# EAGLE design imu (EAGLE 5.12)
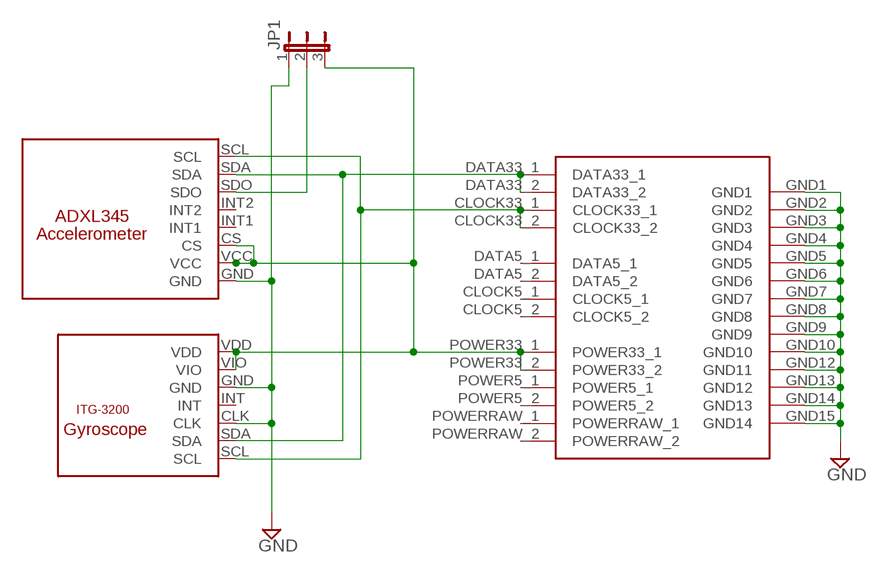
[diagram p0: schematic, sheet 1]

## Parts
JP1  JP2E  [JP2]
U$1  ADXL345_BREAKOUT  [ADXL345_BREAKOUT]
U$2  ITG3200_BREAKOUT  [ITG3200_BREAKOUT]
U$3  OPENSONDE_BUS  [OPENSONDE_BUS]

## Nets
GND: JP1.1 U$1.GND U$2.CLK U$2.GND U$3.GND1 U$3.GND2 U$3.GND3 U$3.GND4 U$3.GND5 U$3.GND6 U$3.GND7 U$3.GND8 U$3.GND9 U$3.GND10 U$3.GND12(GND11) U$3.GND13(GND12) U$3.GND14(GND13) U$3.GND15(GND14)
N$1: U$1.SDA U$2.SDA U$3.DATA33_1 U$3.DATA33_2
N$2: U$1.SCL U$2.SCL U$3.CLOCK33_1 U$3.CLOCK33_2
N$4: JP1.2 U$1.SDO
N$5: JP1.3 U$1.CS U$1.VCC U$2.VDD U$2.VIO U$3.POWER33_1 U$3.POWER33_2
Unconnected: U$1.INT1 U$1.INT2 U$2.INT U$3.CLOCK5_1 U$3.CLOCK5_2 U$3.DATA5_1 U$3.DATA5_2 U$3.POWER5_1 U$3.POWER5_2 U$3.POWERRAW_1 U$3.POWERRAW_2

## Library data of the parts
JP1 = jumper:JP2E: JUMPER
U$1 = Breakouts:ADXL345_BREAKOUT
U$2 = Breakouts:ITG3200_BREAKOUT
U$3 = OpenSondeBus:OPENSONDE_BUS

## Board
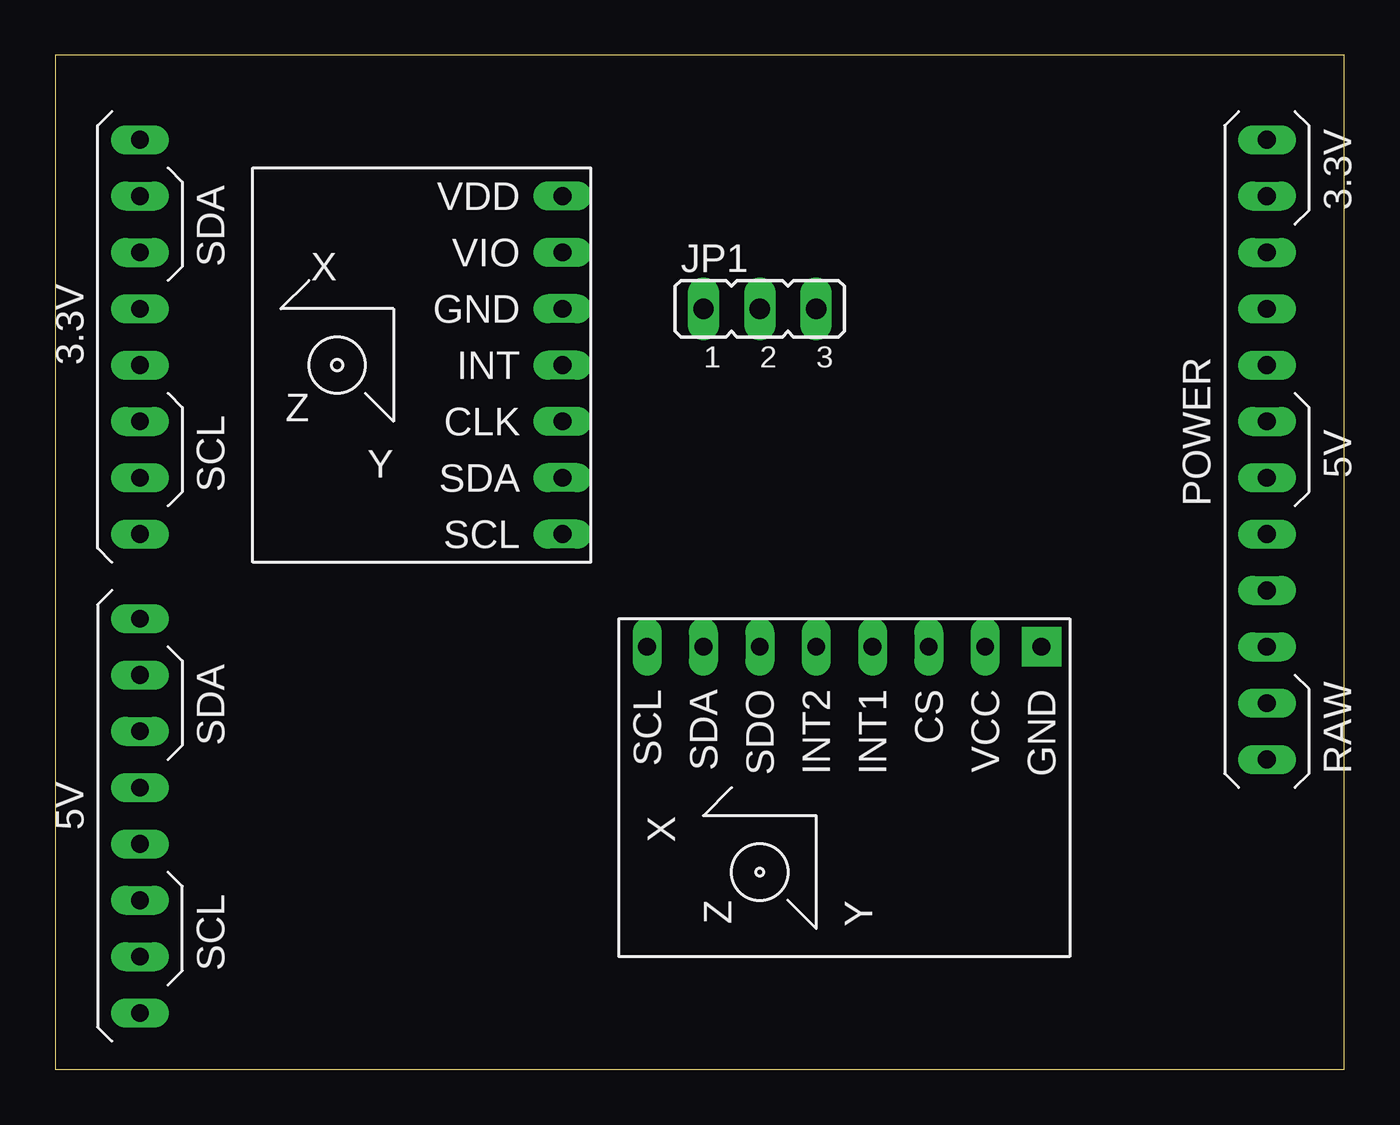
[diagram p1: board, top side]
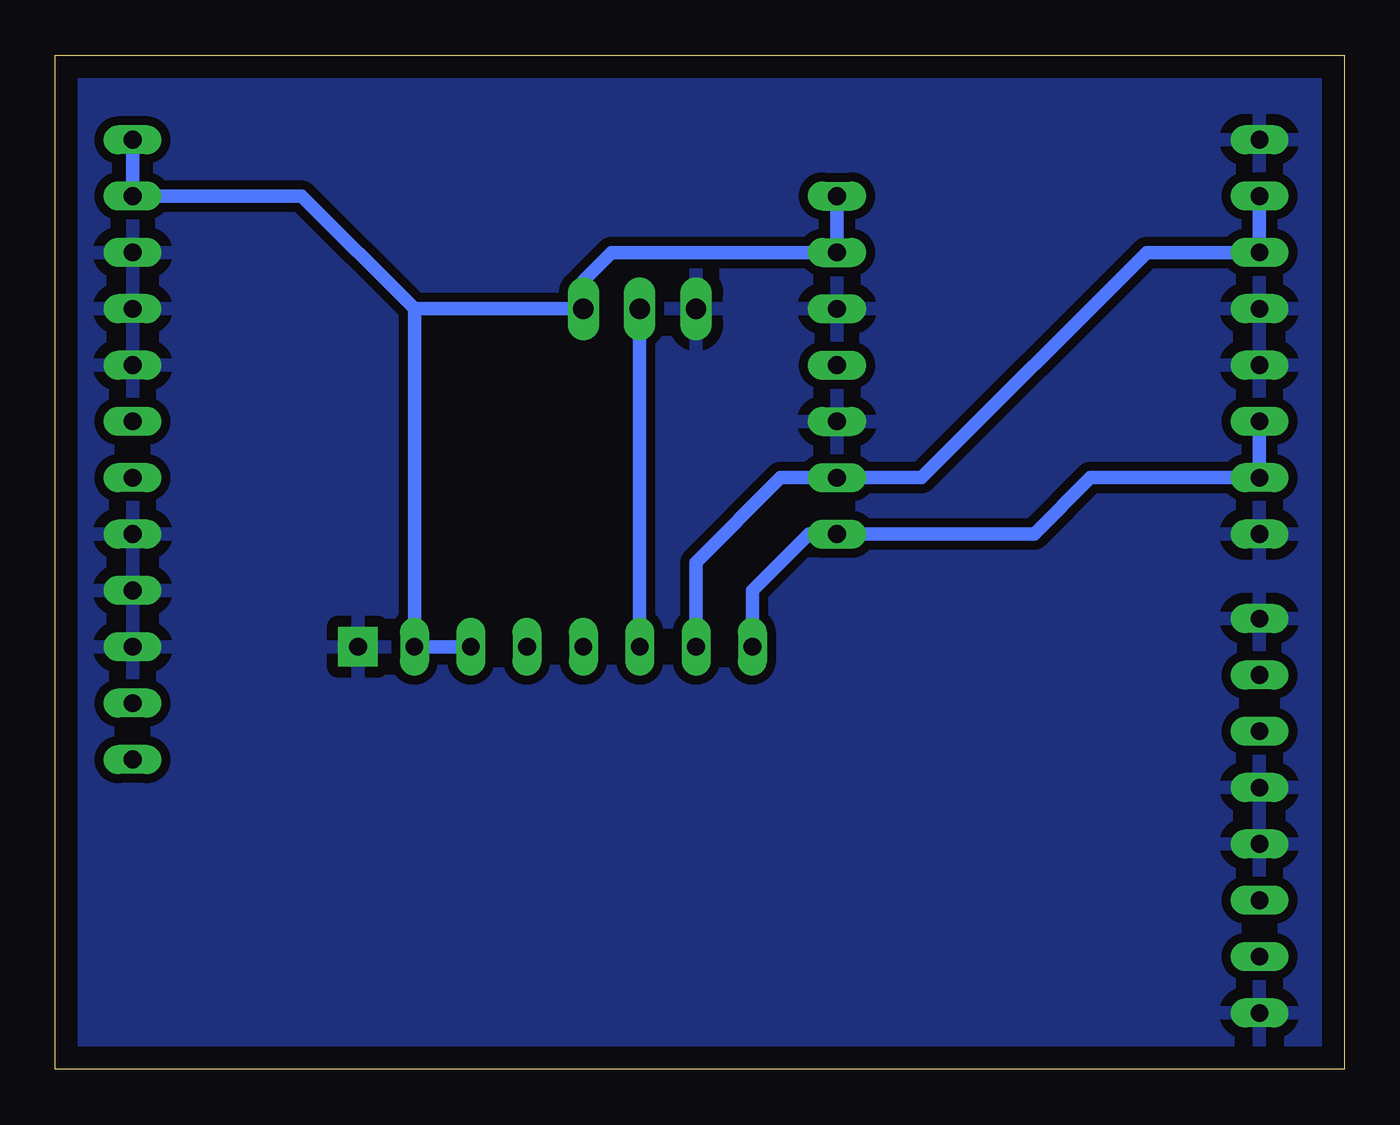
[diagram p2: board, bottom side, seen from below]

Size 58.09 x 45.71 mm. Coordinates in mm from the lower left corner, seen from the top.
Outline: 0,0 58.09,0 58.09,45.71 0,45.71 0,0
Copper layers (1*16): Top 0.035mm / dielectric 1.5mm / Bottom 0.035mm
Design rules "default *": minimum track width 10mil, minimum drill 24mil, track to track 16mil, track to pad 16mil, pad to pad 16mil, via to via 16mil, smd to smd 16mil, copper to edge 40mil, drill to drill 8mil, minimum pad ring 10mil, minimum via ring 8mil, stop-mask expansion 4mil, vias tented up to drill 0mil, thermal gap 20mil

### Footprints (pad centres in the part's own frame; a part is rotated, then mirrored left to right if it is on the bottom)
JP2 = drill 0.914 long: 1 -2.54,0; 2 0,0; 3 2.54,0
ADXL345_BREAKOUT = drill 0.8 long: CS 1.27,13.97; INT1 1.27,11.43; INT2 1.27,8.89; SCL 1.27,1.27; SDA 1.27,3.81; SDO 1.27,6.35; VCC 1.27,16.51 | drill 0.8 pad 1.778 square: GND 1.27,19.05
ITG3200_BREAKOUT = drill 0.8 long: CLK 1.27,11.43; GND 1.27,6.35; INT 1.27,8.89; SCL 1.27,16.51; SDA 1.27,13.97; VDD 1.27,1.27; VIO 1.27,3.81
OPENSONDE_BUS = drill 0.8 long: CLOCK5_1 -25.4,-11.43; CLOCK5_2 -25.4,-13.97; CLOCK33_1 -25.4,10.16; CLOCK33_2 -25.4,7.62; DATA5_1 -25.4,-1.27; DATA5_2 -25.4,-3.81; DATA33_1 -25.4,20.32; DATA33_2 -25.4,17.78; GND1 -25.4,22.86; GND2 -25.4,15.24; GND3 -25.4,12.7; GND4 -25.4,5.08; GND5 -25.4,1.27; GND6 -25.4,-6.35; GND7 -25.4,-8.89; GND8 -25.4,-16.51; GND9 25.4,17.78; GND10 25.4,15.24; GND12 25.4,12.7; GND13 25.4,5.08; GND14 25.4,2.54; GND15 25.4,0; POWER5_1 25.4,10.16; POWER5_2 25.4,7.62; POWER33_1 25.4,22.86; POWER33_2 25.4,20.32; POWERRAW_1 25.4,-2.54; POWERRAW_2 25.4,-5.08

### Placement (x,y rotation side)
JP1  31.75,34.29 0 top
U$1  25.4,20.32 270 top
U$2  24.13,40.64 180 top
U$3  29.21,19.05 0 top

### Tracks (layer width: path | path; a pad name or v marks a point on that pad's centre or on a via)
GND
  pour Bottom: 0,45.72 58.42,45.72 58.42,0 0,0
N$1
  Bottom 0.61: U$1.SDA 29.21,22.86 25.4,26.67 U$2.SDA 19.05,26.67 8.89,36.83 U$3.DATA33_2 U$3.DATA33_1
N$2
  Bottom 0.61: U$1.SCL 26.67,21.59 24.13,24.13 U$2.SCL 13.97,24.13 11.43,26.67 U$3.CLOCK33_2 U$3.CLOCK33_1
N$4
  Bottom 0.61: U$1.SDO JP1.2
N$5
  Bottom 0.61: U$2.VDD U$2.VIO 33.02,36.83 34.29,35.56 JP1.3 41.91,34.29 | U$3.POWER33_1 U$3.POWER33_2 46.99,39.37 41.91,34.29 | 41.91,34.29 U$1.VCC U$1.CS